# Altium schematic sheet nguyen li.SchDoc
size A
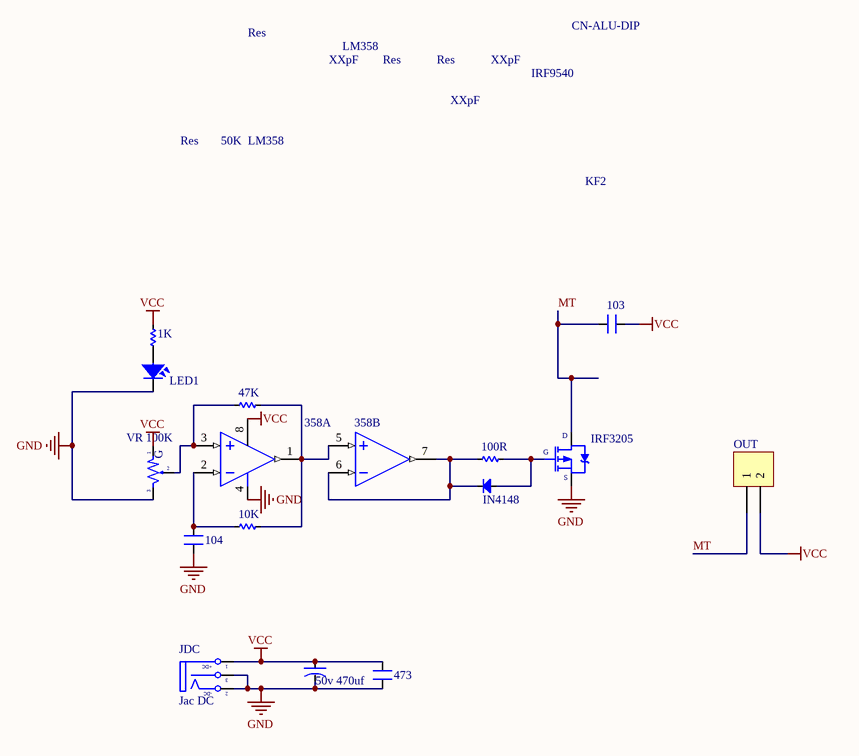
[diagram p0: nguyen li.SchDoc]

## Parts
1K  Res  [RES-1/4W]
10K  Res  [RES-1/4W]
47K  Res  [RES-1/4W]
50v_470uf  CN-ALU-DIP  [CA-ALU-8]
100R  Res  [RES-1/4W]
103  XXpF  [CN1]
104  XXpF  [CN1.5]
358  LM358  [DIP8]  (parts A,B of 2)
473  XXpF  [CN1.5]
IN4148  Diode  [DIO-0.5A-SMALL]  (value not drawn)
IRF3205  IRF9540  [TO220H1]
JDC  Jac DC  [DC0]
LED1  LED  [LED-5-RED]  (value not drawn)
OUT  KF2  [KF2-3.5]
VR_100K  50K  [VR-S1]

## Nets
GND: 50v_470uf.2 104.1 358.4(-V) 473.1 IRF3205.3(S) JDC.2(TN) JDC.3(S) LED1.2 VR_100K.3
VCC: 1K.1 50v_470uf.1 103.2 358.8(+V) 473.2 JDC.1(T) OUT.2 VR_100K.1
MT: 103.1 IRF3205.2(D) OUT.1
Net1K_2: 1K.2 LED1.1
Net10K_1: 10K.1 47K.1 358.1(OUT) 358.5(IN+)
Net10K_2: 10K.2 104.2 358.2(IN-)
Net47K_2: 47K.2 358.3(IN+) VR_100K.2
Net100R_1: 100R.1 IN4148.1(A) IRF3205.1(G)
Net100R_2: 100R.2 358.6(IN-) 358.7(OUT) IN4148.2(K)

## Notes on the sheet
- (in symbol DCIN) +DC; -DC
- (in symbol VR-S) G

## Library data of the parts
1K 10K 47K 100R = Res: Manufacturer: Generic Components; Class: Passive; SubClass: R; Published: 08/06/2000; Publisher: Altium Hobart Technology Centre
50v_470uf = CN-ALU-DIP: Capacitor (Semiconductor SIM Model); Value: 104; LatestRevisionDate: 17-Jul-2002; LatestRevisionNote: Re-released for DXP Platform.; PackageReference: C1206; Publisher: Altium Limited
103 104 473 = CN: Value: 33pF
358 = LM358: Low-Power Dual Operational Amplifier; Value: LM358
IN4148 = Diode: Default Diode; Code - JEDEC: DO-214-AB; Value: 1N5007; Published: 8-Jun-2000; Revision: July-2002: Re-released for DXP Platform.; Publisher: Altium Limited
IRF3205 = IRF9540: HEXFET P-Channel Power MOSFET; Value: IRF840
JDC = DCIN: Jac DC input; Value: Jac DC
LED1 = LED: LED Single colour Green and Red; Value: LED 3 ly Single Colour
OUT = KF2: Manufacturer: Würth Elektronik eiSos GmbH; partNo: 691103110002; ComponentLink1 Description: Manufacturer; ComponentLink2 Description: Datasheet; NoPins: 2; Created Date: 29 October 2013; ComponentLink1URL: http://www.we-online.com; ComponentLink2URL: http://katalog.we-online.de/em/datasheet/6911031100xx.pdf; Created by: Karrer Zheng
VR_100K = VR-S: Var Resistor; Value: Volume 50k